# EAGLE design motor-imu-cape (EAGLE 7.3.0)
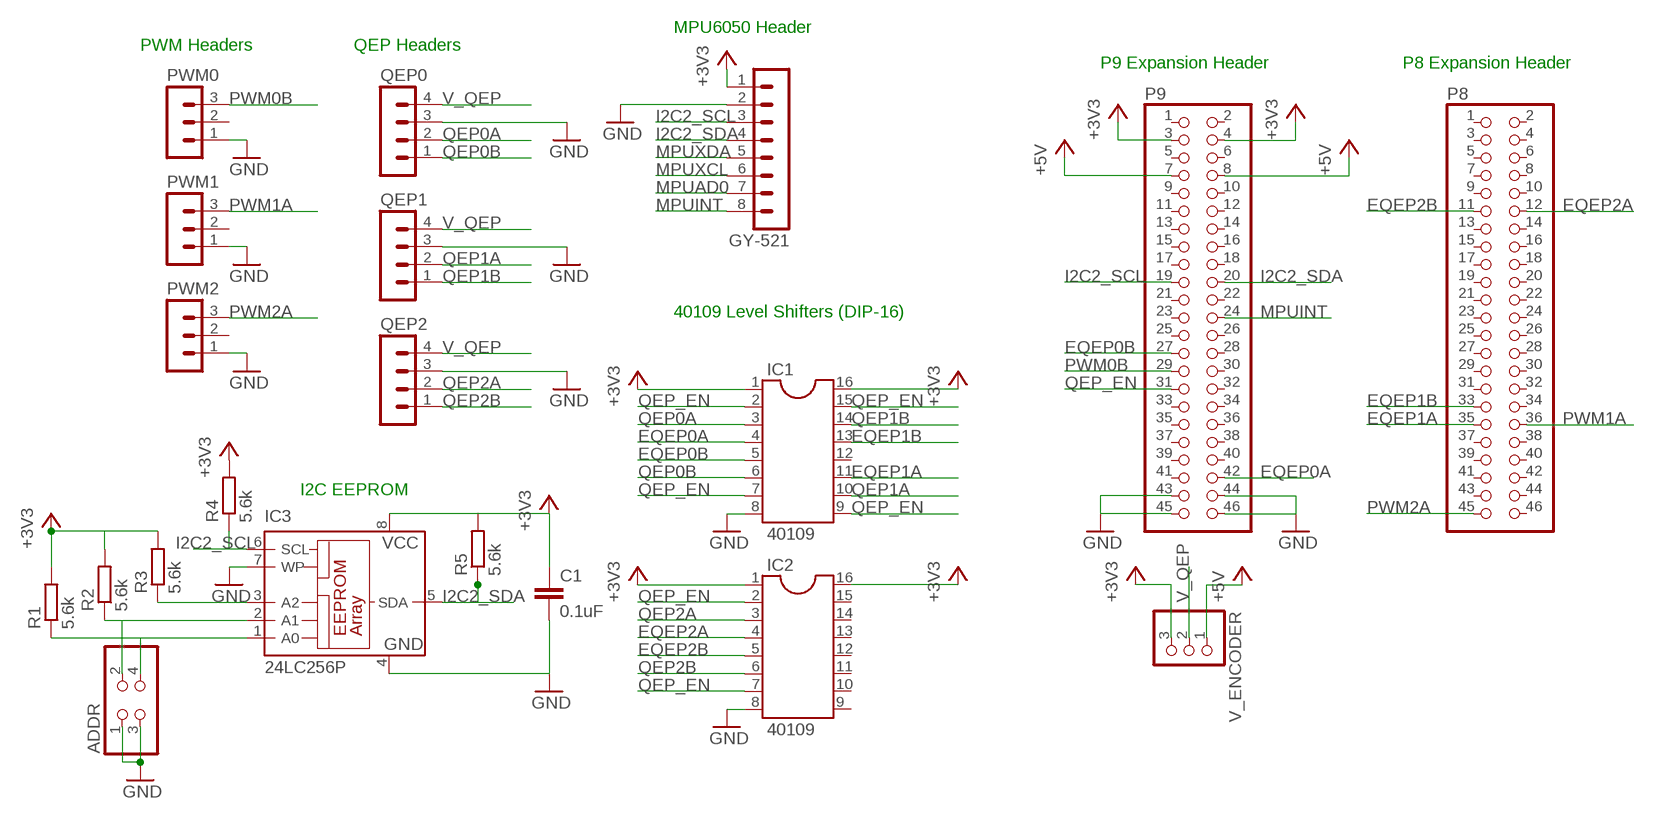
[diagram p0: schematic, sheet 1]

## Parts
ADDR  PINHD-2X2  [2X02]
C1  0.1uF  C-EU025-024X044  [C025-024X044]
GY-521  MA08-1  [MA08-1]
IC1  40109  DIL16  [DIL16]
IC2  40109  DIL16  [DIL16]
IC3  24LC256P  [DIL8]
P8  PINHD-2X23  [2X23]
P9  PINHD-2X23  [2X23]
PWM0  MA03-1  [MA03-1]
PWM1  MA03-1  [MA03-1]
PWM2  MA03-1  [MA03-1]
QEP0  MA04-1  [MA04-1]
QEP1  MA04-1  [MA04-1]
QEP2  MA04-1  [MA04-1]
R1  5.6k  R-EU_0204/7  [0204/7]
R2  5.6k  R-EU_0204/7  [0204/7]
R3  5.6k  R-EU_0204/7  [0204/7]
R4  5.6k  R-EU_0204/7  [0204/7]
R5  5.6k  R-EU_0204/7  [0204/7]
V_ENCODER  PINHD-1X3  [1X03]

## Nets
+3V3: C1.1 GY-521.1 IC1.1 IC1.16 IC2.1 IC2.16 IC3.8(VCC) P9.3 P9.4 R1.2 R2.2 R3.2 R4.2 R5.2 V_ENCODER.3
+5V: P9.7 P9.8 V_ENCODER.1
EQEP0A: IC1.4 P9.42
EQEP0B: IC1.5 P9.27
EQEP1A: IC1.11 P8.35
EQEP1B: IC1.13 P8.33
EQEP2A: IC2.4 P8.12
EQEP2B: IC2.5 P8.11
GND: ADDR.1 ADDR.3 C1.2 GY-521.2 IC1.8 IC2.8 IC3.4(GND) IC3.7(WP) P9.43 P9.44 P9.45 P9.46 PWM0.1 PWM1.1 PWM2.1 QEP0.3 QEP1.3 QEP2.3
I2C2_SCL: GY-521.3 IC3.6(SCL) P9.19 R4.1
I2C2_SDA: GY-521.4 IC3.5(SDA) P9.20 R5.1
MPUAD0: GY-521.7
MPUINT: GY-521.8 P9.24
MPUXCL: GY-521.6
MPUXDA: GY-521.5
N$3: IC3.3(A2) R3.1
N$4: ADDR.2 IC3.2(A1) R2.1
N$5: ADDR.4 IC3.1(A0) R1.1
PWM0B: P9.29 PWM0.3
PWM1A: P8.36 PWM1.3
PWM2A: P8.45 PWM2.3
QEP0A: IC1.3 QEP0.2
QEP0B: IC1.6 QEP0.1
QEP1A: IC1.10 QEP1.2
QEP1B: IC1.14 QEP1.1
QEP2A: IC2.3 QEP2.2
QEP2B: IC2.6 QEP2.1
QEP_EN: IC1.2 IC1.7 IC1.9 IC1.15 IC2.2 IC2.7 P9.31
V_QEP: QEP0.4 QEP1.4 QEP2.4 V_ENCODER.2
Unconnected: IC1.12 IC2.9 IC2.10 IC2.11 IC2.12 IC2.13 IC2.14 IC2.15 P8.1 P8.2 P8.3 P8.4 P8.5 P8.6 P8.7 P8.8 P8.9 P8.10 P8.13 P8.14 P8.15 P8.16 P8.17 P8.18 P8.19 P8.20 P8.21 P8.22 P8.23 P8.24 P8.25 P8.26 P8.27 P8.28 P8.29 P8.30 P8.31 P8.32 P8.34 P8.37 P8.38 P8.39 P8.40 P8.41 P8.42 P8.43 P8.44 P8.46 P9.1 P9.2 P9.5 P9.6 P9.9 P9.10 P9.11 P9.12 P9.13 P9.14 P9.15 P9.16 P9.17 P9.18 P9.21 P9.22 P9.23 P9.25 P9.26 P9.28 P9.30 P9.32 P9.33 P9.34 P9.35 P9.36 P9.37 P9.38 P9.39 P9.40 P9.41 PWM0.2 PWM1.2 PWM2.2

## Notes on the sheet
- MPU6050 Header
- PWM Headers | QEP Headers
- P9 Expansion Header | P8 Expansion Header
- 40109 Level Shifters (DIP-16)
- I2C EEPROM

## Library data of the parts
ADDR = pinhead:PINHD-2X2: PIN HEADER
C1 = rcl:C-EU: CAPACITOR, European symbol
GY-521 = con-lstb:MA08-1: PIN HEADER; OC_FARNELL: unknown; OC_NEWARK: unknown
IC1 IC2 = ic-package:DIL16: Dual In Line / Socket
IC3 = microchip:24*: Serial EEPROM I2C; MF: MICROCHIP; MPN: 24LC256-E/P; OC_FARNELL: 9757970; OC_NEWARK: 92C7169
P8 P9 = pinheader-2x23:PINHD-2X23: PIN HEADER
PWM0 PWM1 PWM2 = con-lstb:MA03-1: PIN HEADER; OC_FARNELL: unknown; OC_NEWARK: unknown
QEP0 QEP1 QEP2 = con-lstb:MA04-1: PIN HEADER; OC_FARNELL: unknown; OC_NEWARK: unknown
R1-R5 = rcl:R-EU_: RESISTOR, European symbol
V_ENCODER = pinhead:PINHD-1X3: PIN HEADER

## Board
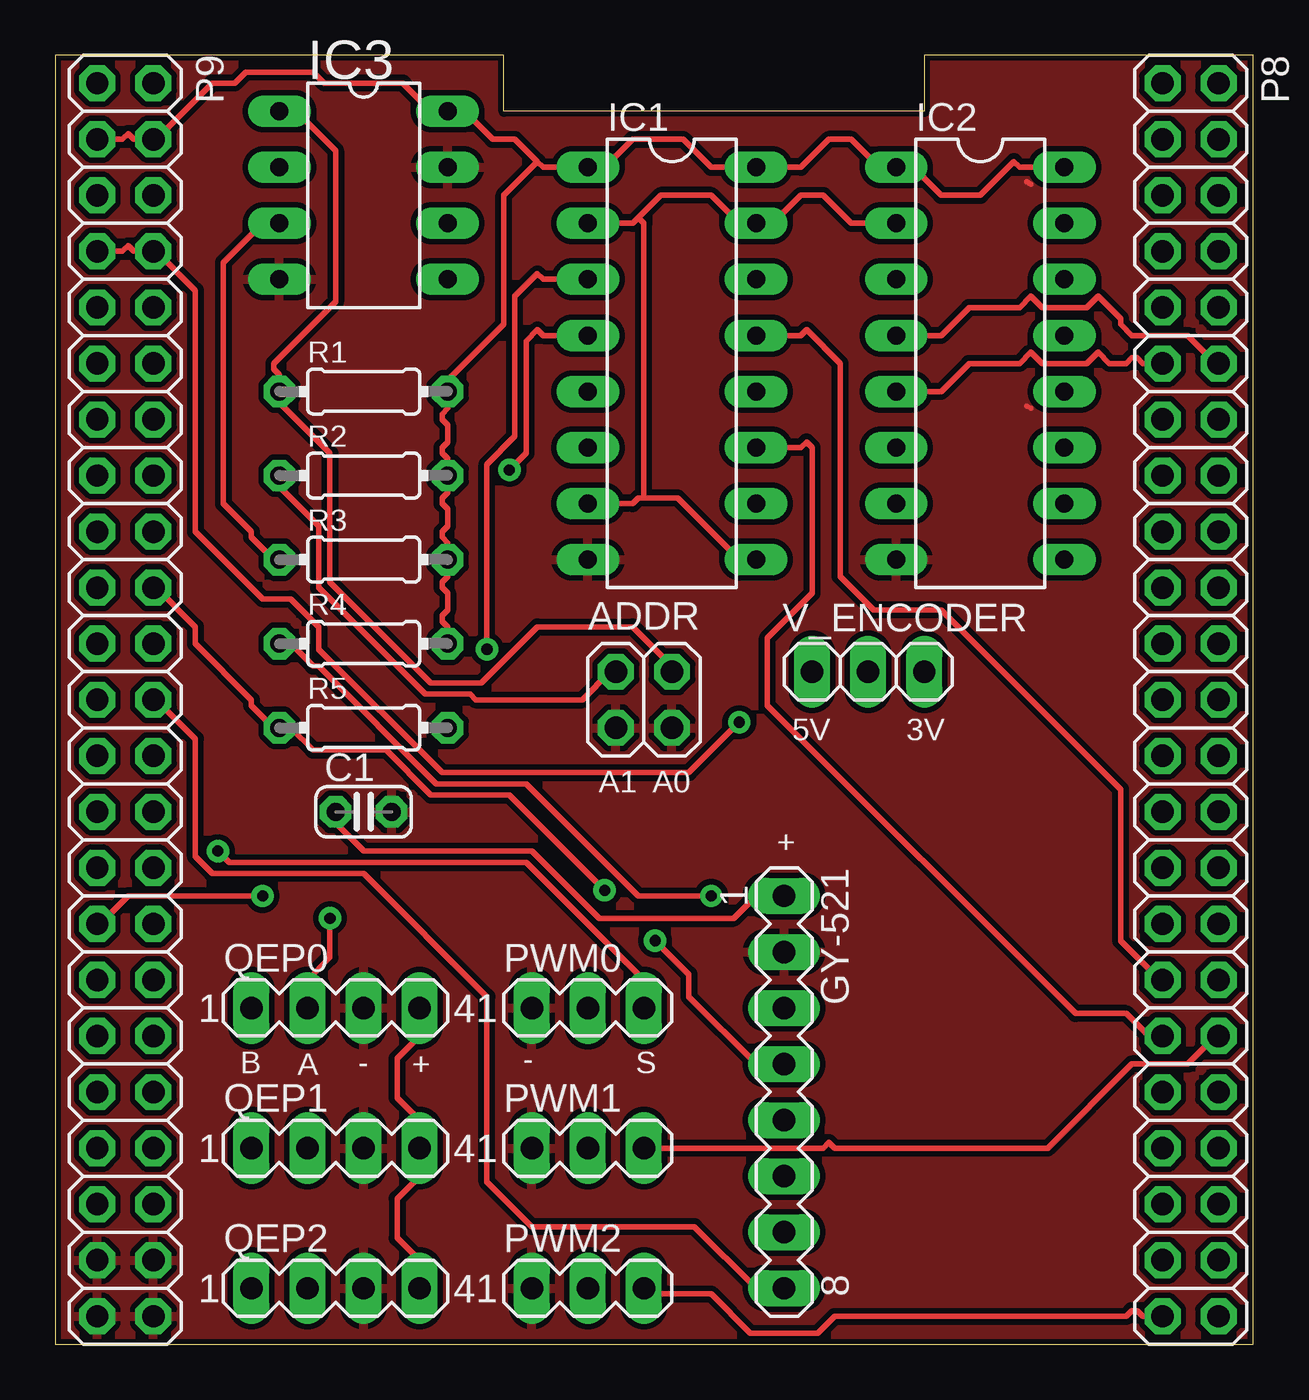
[diagram p1: board, top side]
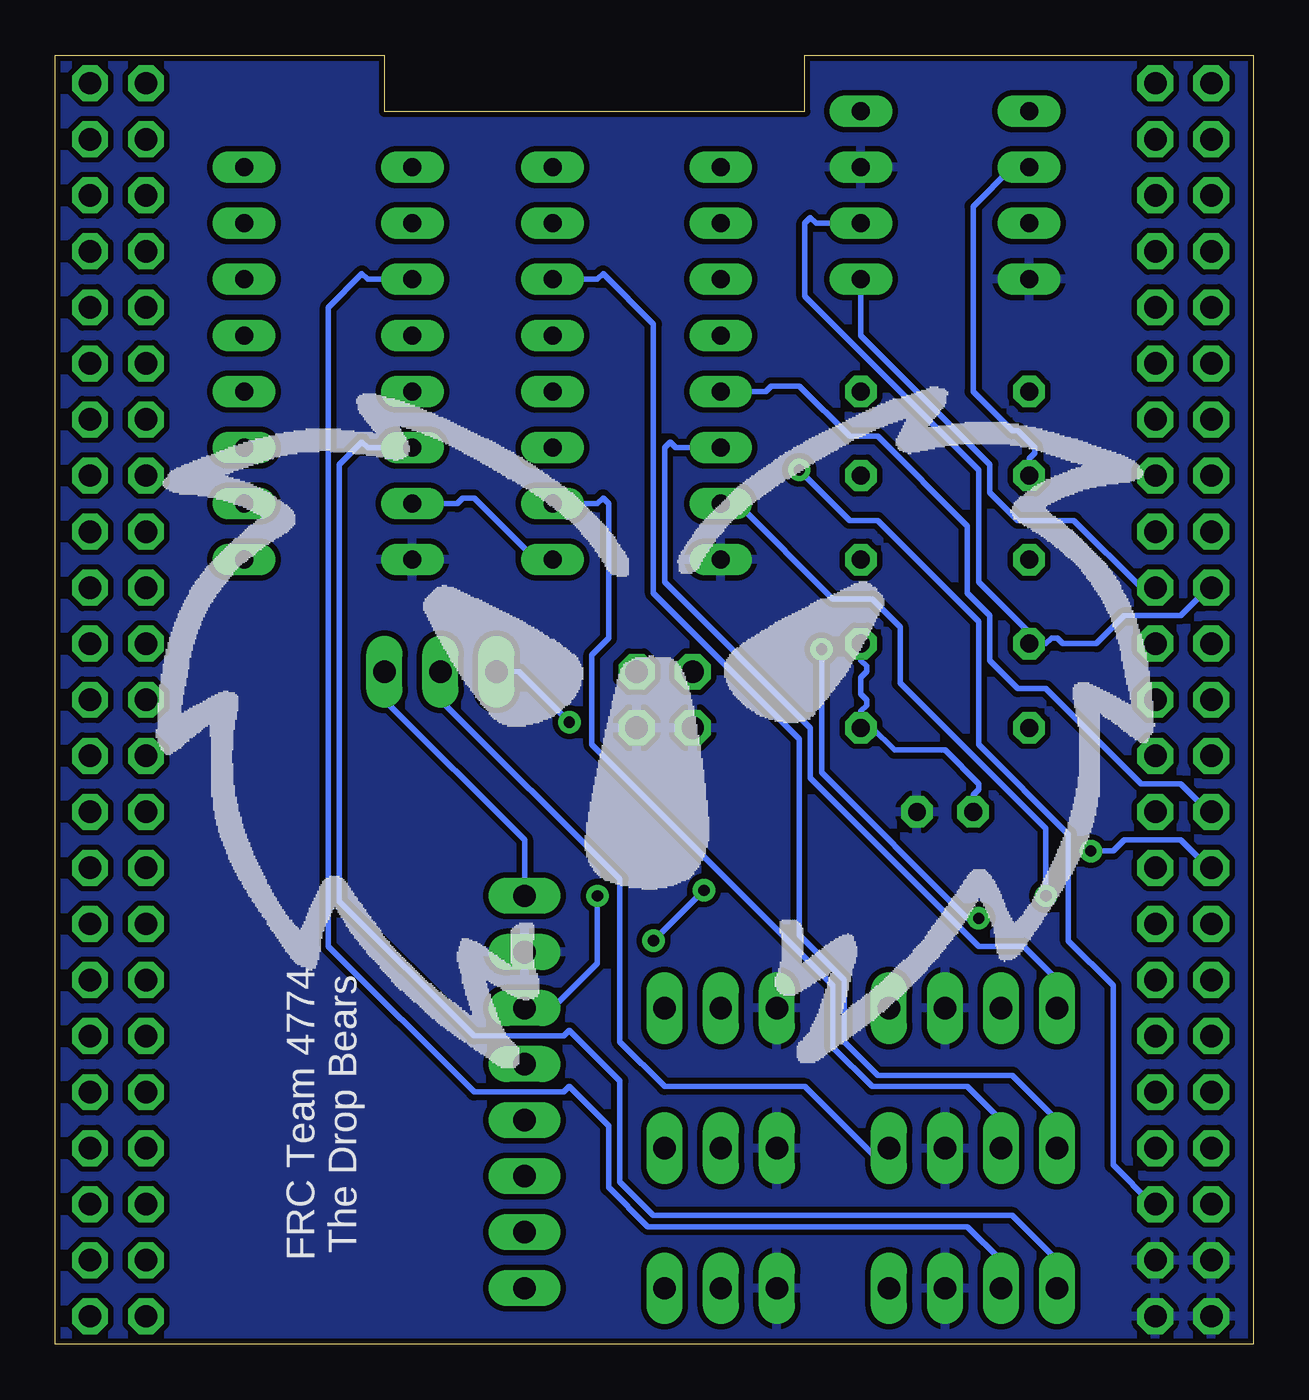
[diagram p2: board, bottom side, seen from below]

Size 54.28 x 58.42 mm. Coordinates in mm from the lower left corner, seen from the top.
Outline: 0,0 54.28,0 54.28,58.41 39.37,58.42 39.37,55.88 20.32,55.88 20.32,58.41 0,58.41 0,0
Copper layers (1*16): Top 0.035mm / dielectric 1.5mm / Bottom 0.035mm
Design rules "SparkFun-10mil": minimum track width 10mil, minimum drill 20mil, track to track 10mil, track to pad 10mil, pad to pad 10mil, via to via 10mil, smd to smd 8mil, copper to edge 10mil, drill to drill 8mil, minimum pad ring 12mil, minimum via ring 10mil, stop-mask expansion 4mil, vias tented up to drill 25mil, thermal gap 10mil

### Footprints (pad centres in the part's own frame; a part is rotated, then mirrored left to right if it is on the bottom)
2X02 = drill 1.016 octagon: 1 -1.27,-1.27; 2 -1.27,1.27; 3 1.27,-1.27; 4 1.27,1.27
C025-024X044 = drill 0.813 octagon: 1 -1.27,0; 2 1.27,0
MA08-1 = drill 1.016 long: 1 -8.89,0; 2 -6.35,0; 3 -3.81,0; 4 -1.27,0; 5 1.27,0; 6 3.81,0; 7 6.35,0; 8 8.89,0
DIL16 = drill 0.813 long: 1 -8.89,-3.81; 2 -6.35,-3.81; 3 -3.81,-3.81; 4 -1.27,-3.81; 5 1.27,-3.81; 6 3.81,-3.81; 7 6.35,-3.81; 8 8.89,-3.81; 9 8.89,3.81; 10 6.35,3.81; 11 3.81,3.81; 12 1.27,3.81; 13 -1.27,3.81; 14 -3.81,3.81; 15 -6.35,3.81; 16 -8.89,3.81
DIL8 = drill 0.813 long: 1 -3.81,-3.81; 2 -1.27,-3.81; 3 1.27,-3.81; 4 3.81,-3.81; 5 3.81,3.81; 6 1.27,3.81; 7 -1.27,3.81; 8 -3.81,3.81
2X23 = drill 1.016 octagon: 1 -27.94,-1.27; 2 -27.94,1.27; 3 -25.4,-1.27; 4 -25.4,1.27; 5 -22.86,-1.27; 6 -22.86,1.27; 7 -20.32,-1.27; 8 -20.32,1.27; 9 -17.78,-1.27; 10 -17.78,1.27; 11 -15.24,-1.27; 12 -15.24,1.27; 13 -12.7,-1.27; 14 -12.7,1.27; 15 -10.16,-1.27; 16 -10.16,1.27; 17 -7.62,-1.27; 18 -7.62,1.27; 19 -5.08,-1.27; 20 -5.08,1.27; 21 -2.54,-1.27; 22 -2.54,1.27; 23 0,-1.27; 24 0,1.27; 25 2.54,-1.27; 26 2.54,1.27; 27 5.08,-1.27; 28 5.08,1.27; 29 7.62,-1.27; 30 7.62,1.27; 31 10.16,-1.27; 32 10.16,1.27; 33 12.7,-1.27; 34 12.7,1.27; 35 15.24,-1.27; 36 15.24,1.27; 37 17.78,-1.27; 38 17.78,1.27; 39 20.32,-1.27; 40 20.32,1.27; 41 22.86,-1.27; 42 22.86,1.27; 43 25.4,-1.27; 44 25.4,1.27; 45 27.94,-1.27; 46 27.94,1.27
MA03-1 = drill 1.016 long: 1 -2.54,0; 2 0,0; 3 2.54,0
MA04-1 = drill 1.016 long: 1 -3.81,0; 2 -1.27,0; 3 1.27,0; 4 3.81,0
0204/7 = drill 0.813 octagon: 1 -3.81,0; 2 3.81,0
1X03 = drill 1.016 long: 1 -2.54,0; 2 0,0; 3 2.54,0

### Placement (x,y rotation side)
ADDR  26.67,29.21 0 top
C1  13.97,24.13 0 top
GY-521  33.02,11.43 270 top
IC1  27.94,44.45 270 top
IC2  41.91,44.45 270 top
IC3  13.97,52.07 270 top
P8  51.44,29.21 270 top
P9  3.17,29.21 270 top
PWM0  24.13,15.24 0 top
PWM1  24.13,8.89 0 top
PWM2  24.13,2.54 0 top
QEP0  12.7,15.24 0 top
QEP1  12.7,8.89 0 top
QEP2  12.7,2.54 0 top
R1  13.97,43.18 0 top
R2  13.97,39.37 0 top
R3  13.97,35.56 0 top
R4  13.97,31.75 0 top
R5  13.97,27.94 0 top
V_ENCODER  36.83,30.48 0 top

### Tracks (layer width: path | path; a pad name or v marks a point on that pad's centre or on a via)
+3V3
  Top 0.254: IC2.16 43.69,53.34 43.43,53.59 41.91,52.07 40.13,52.07 38.86,53.34 IC2.1 37.34,53.34 36.07,54.61 35.05,54.61 33.78,53.34 IC1.16 29.72,53.34 28.45,54.61 26.16,54.61 24.89,53.34 IC1.1 22.1,53.34 21.84,53.59 | P9.3 3.05,54.61 3.3,54.86 3.56,54.61 P9.4 4.57,54.61 7.11,57.15 8.13,57.15 8.64,57.66 11.68,57.66 12.19,57.15 15.75,57.15 17.02,55.88 IC3.8 18.54,55.88 19.81,54.61 20.83,54.61 21.84,53.59 | R4.2 17.78,32.51 17.53,32.77 17.53,33.02 17.78,33.27 17.78,34.04 17.53,34.29 17.53,34.54 17.78,34.8 R3.2 17.78,36.32 17.53,36.58 17.53,36.83 17.78,37.08 17.78,37.85 17.53,38.1 17.53,38.35 17.78,38.61 R2.2 17.78,40.13 17.53,40.39 17.53,40.64 17.78,40.89 17.78,41.66 17.53,41.91 17.53,42.16 17.78,42.42 R1.2 17.78,43.69 20.32,46.23 20.32,52.07 21.84,53.59 | GY-521.1 31.75,20.32 30.73,19.3 24.64,19.3 21.59,22.35 13.97,22.35 12.7,23.62 C1.1
  Bottom 0.254: GY-521.1 33.02,22.86 39.37,29.21 V_ENCODER.3 | C1.1 12.7,24.89 12.45,25.15 12.45,25.4 13.97,26.92 16.26,26.92 17.27,27.94 R5.2 17.78,28.7 17.53,28.96 17.53,29.21 17.78,29.46 17.78,30.23 17.53,30.48 17.53,30.73 17.78,30.99 R4.2
+5V  (via drill 0.51)
  Top 0.254: P9.7 3.05,49.53 3.3,49.78 3.56,49.53 P9.8 4.57,49.53 6.35,47.75 6.35,36.83 9.4,33.78 10.67,33.78 11.94,32.51 11.94,31.5 17.53,25.91 28.7,25.91 v30.99,28.19
  Bottom 0.254: V_ENCODER.1 33.27,30.48 v30.99,28.19
EQEP0A  (via drill 0.51)
  Top 0.254: IC1.4 22.1,45.72 21.84,45.97 21.34,45.47 21.34,40.39 v20.57,39.62
  Bottom 0.254: v20.57,39.62 18.29,37.34 17.02,37.34 12.45,32.77 12.45,27.18 8.38,23.11 8.38,18.29 6.35,16.26 6.35,8.13 4.57,6.35 P9.42
EQEP0B
  Bottom 0.254: IC1.5 22.1,43.18 21.84,43.43 20.57,43.43 18.29,41.15 17.02,41.15 12.95,37.08 12.95,34.04 11.94,33.02 11.94,30.99 10.67,29.72 9.4,29.72 5.08,25.4 3.3,25.4 2.03,24.13 P9.27
EQEP1A
  Top 0.254: IC1.11 33.78,40.64 34.04,40.89 34.29,40.64 34.29,34.04 32.26,32 32.26,28.96 46.23,14.99 48.51,14.99 49.53,13.97 P8.35
EQEP1B
  Top 0.254: IC1.13 33.78,45.72 34.04,45.97 35.56,44.45 35.56,34.8 37.08,33.27 40.13,33.27 48.26,25.15 48.26,18.29 50.04,16.51 P8.33
EQEP2A
  Top 0.254: IC2.4 40.13,45.72 41.4,46.99 43.69,46.99 44.2,47.5 44.7,46.99 46.74,46.99 47.24,47.5 48.26,46.48 48.26,46.23 48.77,45.72 51.31,45.72 52.58,44.45 P8.12
EQEP2B
  Top 0.254: IC2.5 40.13,43.18 41.4,44.45 43.69,44.45 44.2,44.96 44.7,44.45 46.74,44.45 47.24,44.96 47.75,44.45 48.51,44.45 48.77,44.7 49.02,44.7 49.28,44.45 P8.11
GND
  Top 0.254: 44.2,52.58 44.02,52.68 | 44.2,42.42 44.02,42.52
  pour Bottom (isolate 0.254): 0,58.42 20.32,58.42 20.32,55.88 39.37,55.88 39.37,58.42 54.61,58.42 54.61,0 0,0
  pour Top (isolate 0.254): 0,58.42 20.32,58.42 20.32,55.88 39.37,55.88 39.37,58.42 54.61,58.42 54.61,0 0,0
I2C2_SCL  (via drill 0.51)
  Top 0.254: v29.72,20.32 26.42,20.32 21.34,25.4 17.27,25.4 11.94,30.73 11.68,30.73 10.67,31.75 R4.1
  Bottom 0.254: 9.65,31.75 9.4,31.75 9.14,32 8.89,32 8.64,31.75 7.11,31.75 5.84,33.02 3.3,33.02 2.03,34.29 P9.19 | IC3.6 19.81,50.8 20.07,51.05 20.32,50.8 20.32,47.5 12.45,39.62 12.45,34.54 9.65,31.75 | 9.65,31.75 R4.1 | GY-521.3 31.75,15.24 29.72,17.27 v29.72,20.32
I2C2_SDA  (via drill 0.51)
  Top 0.254: P9.20 4.57,34.29 6.35,32.51 6.35,31.75 8.89,29.21 8.89,28.96 9.91,27.94 R5.1 10.67,27.94 11.68,26.92 14.99,26.92 17.02,24.89 20.57,24.89 v24.89,20.57 | GY-521.4 31.75,12.7 28.7,15.75 28.7,16.76 v27.18,18.29
  Bottom 0.254: IC3.5 17.78,45.72 11.94,39.88 11.94,38.61 10.67,37.34 8.13,37.34 5.08,34.29 P9.20 | v24.89,20.57 v27.18,18.29
MPUINT
  Top 0.254: GY-521.8 31.75,2.54 28.96,5.33 21.59,5.33 19.56,7.37 19.56,15.75 13.97,21.34 7.11,21.34 6.35,22.1 6.35,27.43 4.57,29.21 P9.24
N$3
  Top 0.254: R3.1 9.91,35.56 8.89,36.58 8.89,36.83 7.62,38.1 7.62,49.02 9.4,50.8 IC3.3
N$4
  Top 0.254: ADDR.2 25.15,30.48 23.88,29.21 19.05,29.21 18.8,29.46 16.76,29.46 11.94,34.29 11.94,37.08 10.16,38.86 R2.1
  Bottom 0.254: R2.1 10.16,40.13 9.91,40.39 9.91,40.64 10.67,41.4 10.92,41.4 12.7,43.18 12.7,51.56 10.92,53.34 IC3.2
N$5
  Top 0.254: IC3.1 10.92,55.88 12.7,54.1 12.7,47.24 9.91,44.45 9.91,44.2 10.16,43.94 R1.1 10.16,42.67 12.45,40.39 12.45,34.54 17.02,29.97 19.3,29.97 21.84,32.51 26.16,32.51 27.94,30.73 ADDR.4
PWM0B  (via drill 0.51)
  Top 0.254: PWM0.3 26.67,16.51 21.34,21.84 7.87,21.84 v7.37,22.35
  Bottom 0.254: v7.37,22.35 6.35,22.35 5.84,22.86 3.3,22.86 2.03,21.59 P9.29
PWM1A
  Top 0.254: PWM1.3 34.8,8.89 35.05,9.14 35.31,8.89 44.96,8.89 48.77,12.7 51.31,12.7 52.58,13.97 P8.36
PWM2A
  Top 0.254: P8.45 49.28,1.27 49.02,1.52 48.77,1.52 48.51,1.27 35.31,1.27 34.54,0.51 31.5,0.51 29.72,2.29 26.92,2.29 PWM2.3
QEP0A  (via drill 0.51)
  Top 0.254: IC1.3 22.1,48.26 21.84,48.51 20.83,47.5 20.83,41.15 19.56,39.88 v19.56,31.5 | v12.45,19.3 12.45,17.53 11.43,16.51 QEP0.2
  Bottom 0.254: v19.56,31.5 19.56,25.91 12.95,19.3 v12.45,19.3
QEP0B
  Bottom 0.254: IC1.6 26.16,40.64 26.42,40.89 26.67,40.64 26.67,34.54 20.07,27.94 20.07,25.65 12.45,18.03 10.41,18.03 8.89,16.51 QEP0.1
QEP1A
  Bottom 0.254: IC1.10 29.72,38.1 29.46,38.35 29.21,38.1 29.21,32 29.97,31.24 29.97,27.18 19.05,16.26 19.05,13.46 17.27,11.68 12.95,11.68 11.43,10.16 QEP1.2
QEP1B
  Bottom 0.254: IC1.14 29.72,48.26 29.46,48.51 27.18,46.23 27.18,34.04 20.57,27.43 20.57,18.54 18.54,16.51 18.54,13.72 17.02,12.19 10.92,12.19 8.89,10.16 QEP1.1
QEP2A
  Bottom 0.254: IC2.3 40.13,48.26 40.39,48.51 41.91,46.99 41.91,18.03 35.31,11.43 31.24,11.43 30.99,11.68 29.21,9.91 29.21,7.11 27.43,5.33 12.95,5.33 11.43,3.81 QEP2.2
QEP2B
  Bottom 0.254: IC2.6 40.13,40.64 40.39,40.89 41.4,39.88 41.4,20.07 35.31,13.97 31.24,13.97 30.99,14.22 28.7,11.94 28.7,7.37 27.18,5.84 10.92,5.84 8.89,3.81 QEP2.1
QEP_EN  (via drill 0.51)
  Top 0.254: IC1.2 26.16,50.8 26.42,51.05 | 26.42,51.05 27.43,52.07 29.72,52.07 30.99,50.8 IC1.15 32.51,50.8 33.78,52.07 34.8,52.07 36.07,50.8 IC2.2 | IC1.7 26.16,38.1 26.42,38.35 26.67,38.35 | 26.67,38.35 28.19,38.35 30.99,35.56 IC1.9 | v9.4,20.32 3.3,20.32 2.03,19.05 P9.31 | 26.42,51.05 26.67,50.8 26.67,38.35
  Bottom 0.254: IC2.7 36.07,38.1 35.81,38.35 35.31,38.35 32.51,35.56 IC1.9 | v9.4,20.32 9.4,23.37 16,29.97 16,32.51 17.27,33.78 19.05,33.78 23.37,38.1 IC1.7
V_QEP
  Top 0.254: QEP2.4 16.51,3.81 15.49,4.83 15.49,6.6 16.51,7.62 QEP1.4 16.51,10.16 15.49,11.18 15.49,12.95 16.51,13.97 QEP0.4
  Bottom 0.254: V_ENCODER.2 36.83,29.21 28.7,21.08 28.7,13.72 26.67,11.68 20.32,11.68 17.27,8.64 16.76,8.64 QEP1.4

### Text on the board
tPlace: 5V | 3V | A1 | A0 | + | B | A | - | + | - | S
bPlace: FRC Team 4774 / The Drop Bears